# EAGLE design audino1012_ui (EAGLE 6.2)
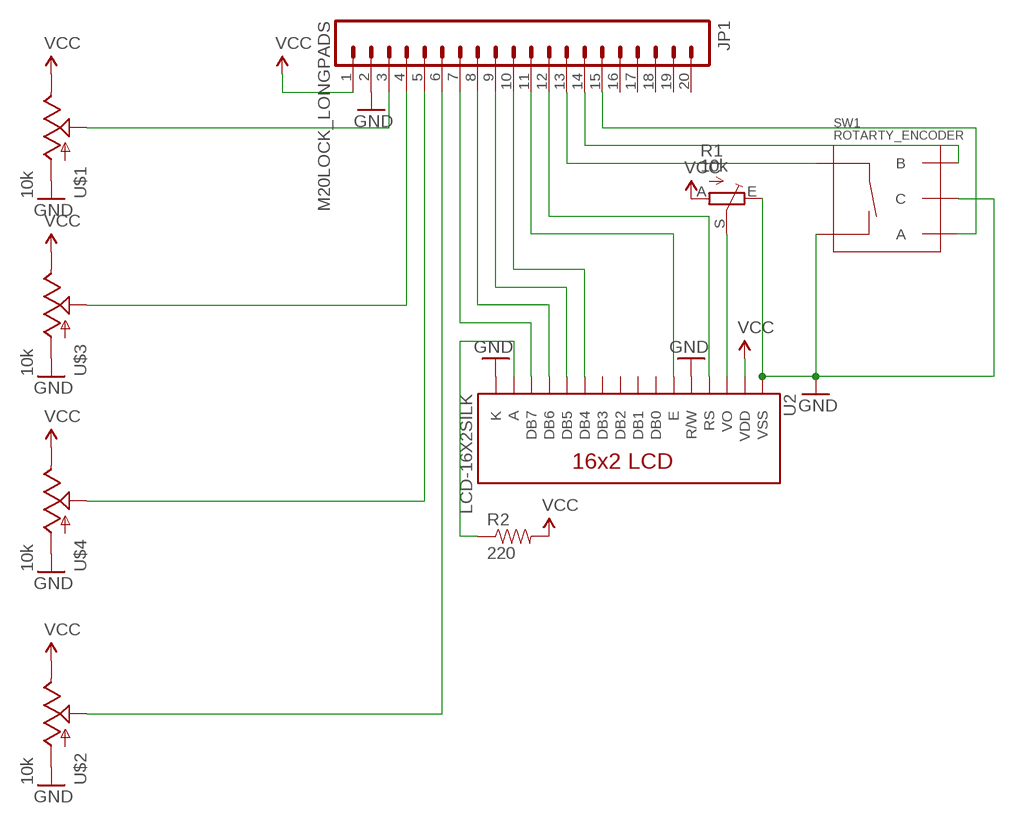
[diagram p0: schematic, sheet 1]

## Parts
JP1  M20LOCK_LONGPADS  [1X20_LOCK_LONGPADS]
R1  10k  TRIM_EU-RJ9W  [RJ9W]
R2  220  RESISTORKIT  [AXIAL-0.3-KIT]
SW1  ROTARTY_ENCODER  [ROTARY_ENC_PLAIN]
U2  LCD-16X2SILK  [LCD-16X2]
U$1  10k  POT  [ALPS_POT]
U$2  10k  POT  [ALPS_POT]
U$3  10k  POT  [ALPS_POT]
U$4  10k  POT  [ALPS_POT]

## Nets
GND: JP1.2 R1.E SW1.C SW1.SW- U2.1(VSS) U2.5(R/W) U2.16(K) U$1.P$3(A) U$2.P$3(A) U$3.P$3(A) U$4.P$3(A)
N$1: JP1.16
N$2: JP1.3 U$1.P$2(S)
N$3: JP1.4 U$3.P$2(S)
N$4: JP1.5 U$4.P$2(S)
N$5: JP1.6 U$2.P$2(S)
N$6: JP1.7 U2.14(DB7)
N$7: JP1.8 U2.13(DB6)
N$8: JP1.9 U2.12(DB5)
N$9: JP1.10 U2.11(DB4)
N$10: JP1.11 U2.6(E)
N$11: JP1.12 U2.4(RS)
N$12: R1.S U2.3(VO)
N$13: JP1.13 SW1.SW+
N$14: JP1.14 SW1.B
N$15: JP1.15 SW1.A
N$16: R2.P$1 U2.15(A)
VCC: JP1.1 R1.A R2.P$2 U2.2(VDD) U$1.P$1(E) U$2.P$1(E) U$3.P$1(E) U$4.P$1(E)
Unconnected: JP1.17 JP1.18 JP1.19 JP1.20 U2.7(DB0) U2.8(DB1) U2.9(DB2) U2.10(DB3)

## Library data of the parts
JP1 = SparkFun-Connectors:M20: 1x20 .1" header This is just like the LOCK variant in that the holes are staggared by 5 mil, but except for the last two holes. They are not altered from the "standard" footprint layout. This is used for a special purpose on the layout of our Graphic LCD Backpack. Make sure you want to use this device before selecting it for you project!
R1 = pot:TRIM_EU-: POTENTIOMETER
R2 = SparkFun-Passives:RESISTOR: Resistor Basic schematic elements and footprints for 0603, 1206, and PTH resistors.
SW1 = SparkFun-Electromechanical:ROTARTY_ENCODER: Simple no LED rotary encoder Example: COM-09117
U2 = SparkFun-Displays:LCD-16X2: Standard text-only 16x2 parallel input LCD
U$1-U$4 = SparkFun-Electromechanical:POT

## Board
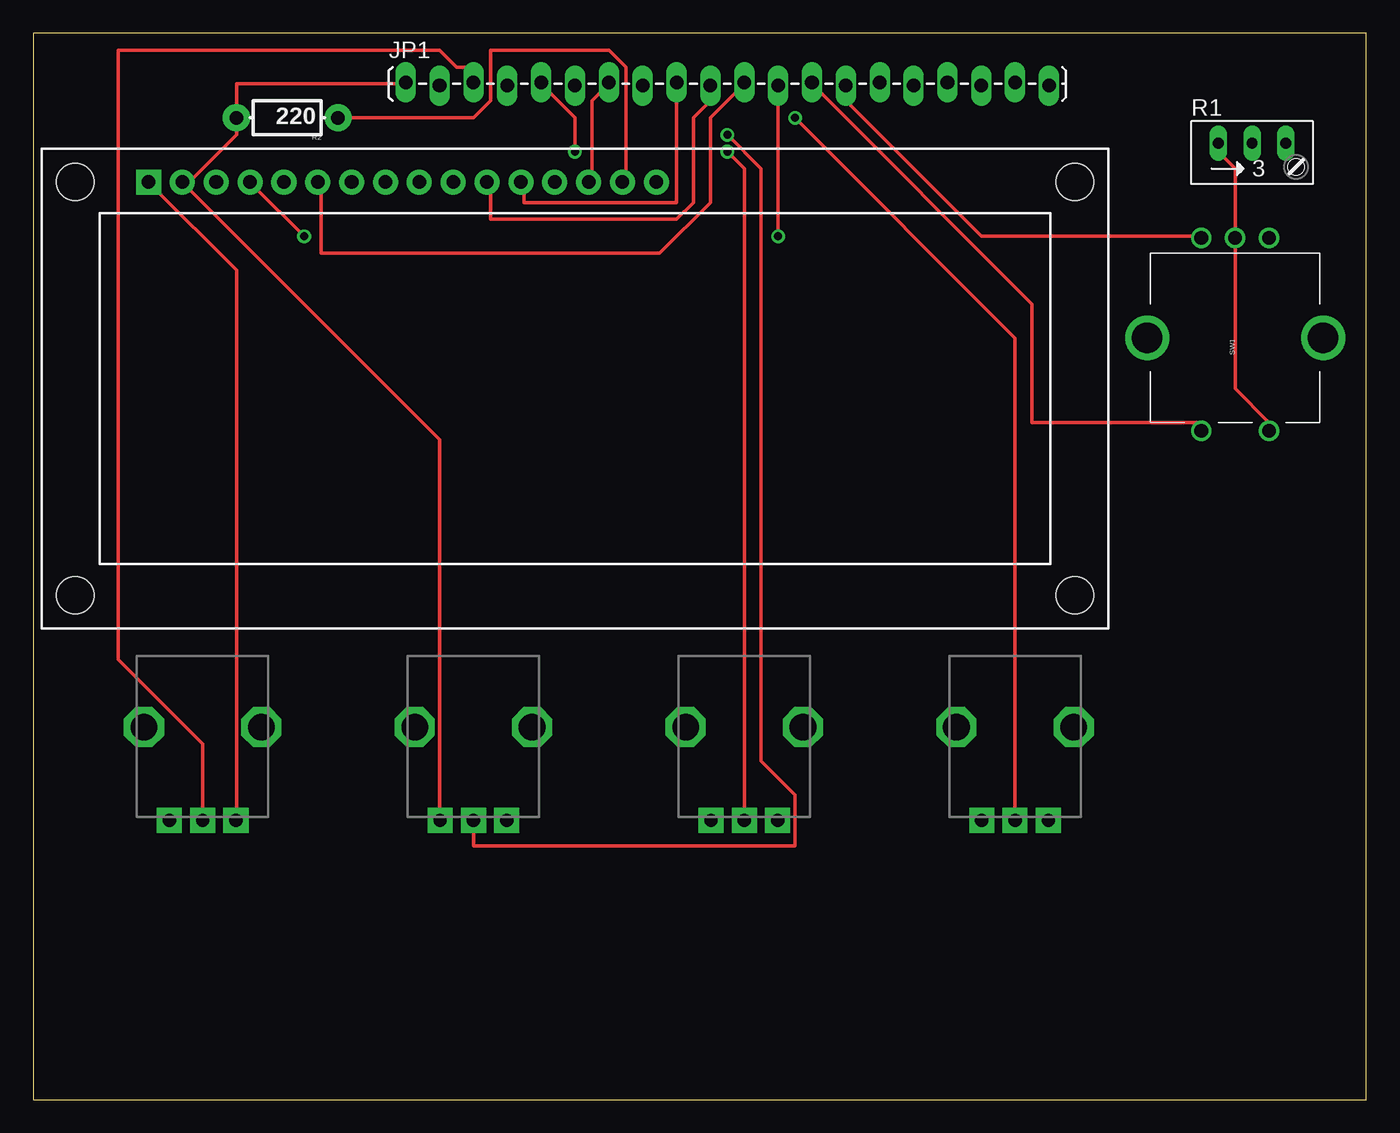
[diagram p1: board, top side]
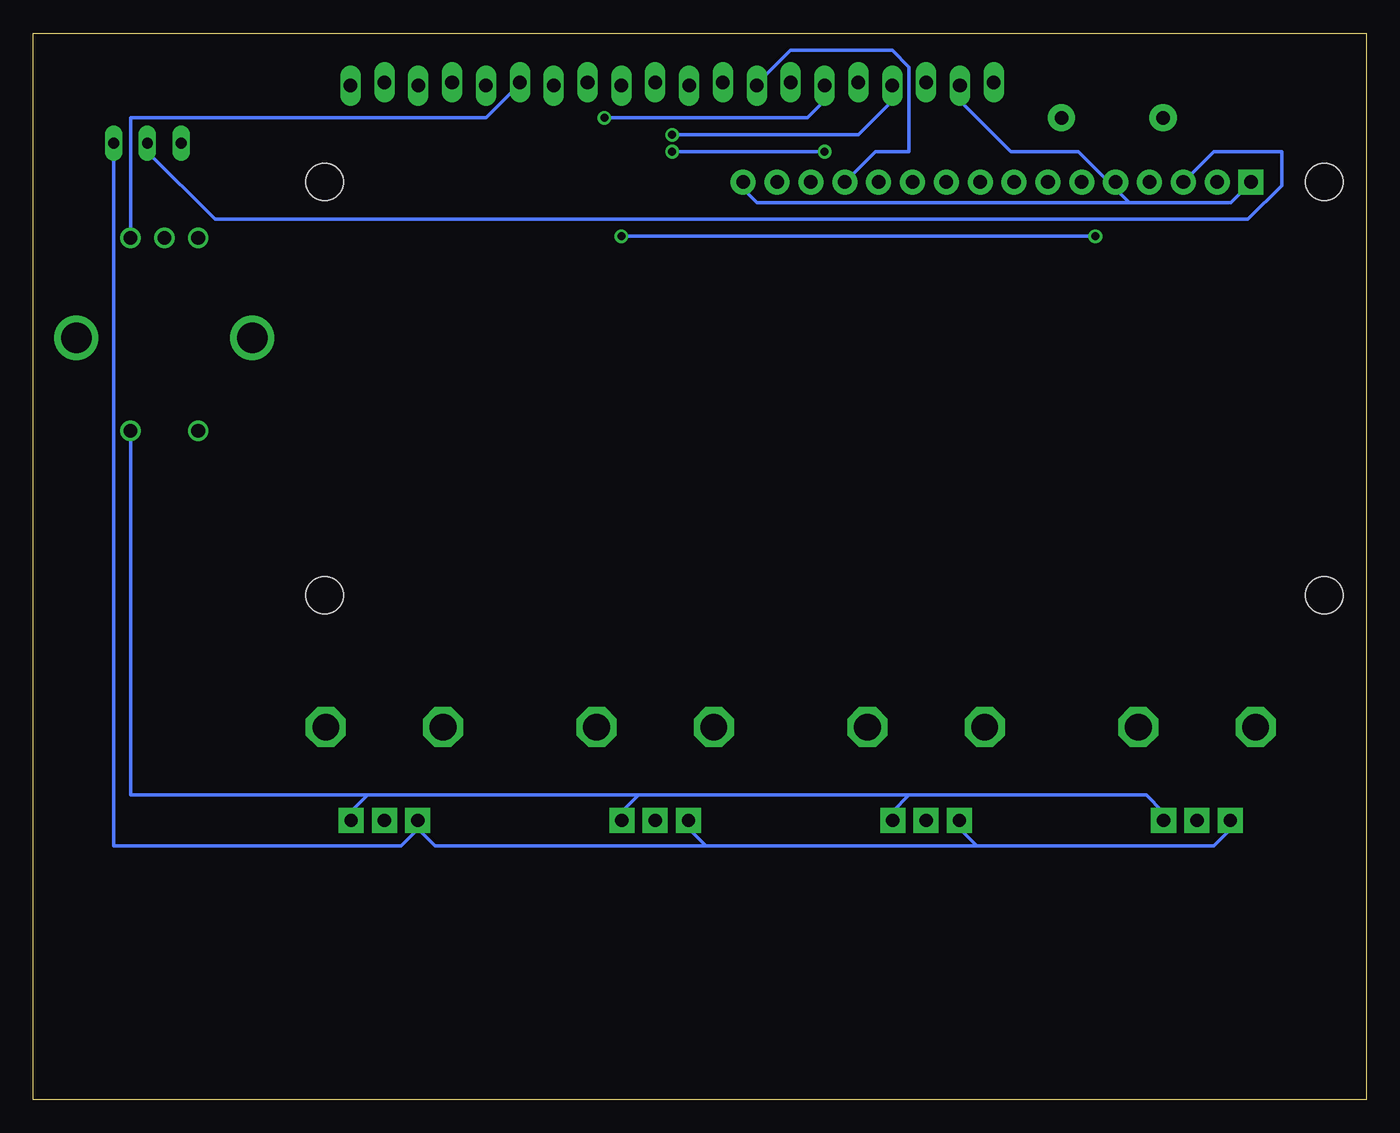
[diagram p2: board, bottom side, seen from below]

Size 100 x 80 mm. Coordinates in mm from the lower left corner, seen from the top.
Outline: 0,0 100,0 100,80 0,80 0,0
Copper layers (1*16): Top 0.035mm / dielectric 1.5mm / Bottom 0.035mm
Design rules: minimum track width 10mil, minimum drill 24mil, track to track 8mil, track to pad 8mil, pad to pad 8mil, via to via 8mil, smd to smd 8mil, copper to edge 40mil, drill to drill 8mil, minimum pad ring 10mil, minimum via ring 8mil, stop-mask expansion 4mil, vias tented up to drill 0mil, thermal gap 10mil

### Footprints (pad centres in the part's own frame; a part is rotated, then mirrored left to right if it is on the bottom)
1X20_LOCK_LONGPADS = drill 1.016 long: 1 0,0.127; 2 2.54,-0.127; 3 5.08,0.127; 4 7.62,-0.127; 5 10.16,0.127; 6 12.7,-0.127; 7 15.24,0.127; 8 17.78,-0.127; 9 20.32,0.127; 10 22.86,-0.127; 11 25.4,0.127; 12 27.94,-0.127; 13 30.48,0.127; 14 33.02,-0.127; 15 35.56,0.127; 16 38.1,-0.127; 17 40.64,0.127; 18 43.18,-0.127; 19 45.72,0.127; 20 48.26,-0.127
RJ9W = drill 0.813 long: A 2.54,0.635; E -2.54,0.635; S 0,0.635
AXIAL-0.3-KIT = drill 1.016 pad 2.032: P$1 -3.81,0; P$2 3.81,0
ROTARY_ENC_PLAIN = drill 1.016: A 7.493,-2.54; B 7.493,2.54; C 7.493,0; SW+ -6.985,2.54; SW- -6.985,-2.54 | drill 2.286: P$3 0,6.604; P$4 0,-6.604
LCD-16X2 = drill 1.016 pad 1.88 square: 1 -32,15.5 | drill 1.016 pad 1.88: 2 -29.46,15.5; 3 -26.92,15.5; 4 -24.38,15.5; 5 -21.84,15.5; 6 -19.3,15.5; 7 -16.76,15.5; 8 -14.22,15.5; 9 -11.68,15.5; 10 -9.14,15.5; 11 -6.6,15.5; 12 -4.06,15.5; 13 -1.52,15.5; 14 1.02,15.5; 15 3.56,15.5; 16 6.1,15.5 | hole 2.8: -37.5,15.5; -37.5,-15.5; 37.5,15.5; 37.5,-15.5
ALPS_POT = drill 1 pad 1.88 square: P$1 7,-2.5; P$2 7,0; P$3 7,2.5 | drill 2 octagon: P$4 0,-4.4; P$5 0,4.4

### Placement (x,y rotation side)
JP1  27.94,76.2 0 top
R1  91.44,71.12 0 top
R2  19.05,73.66 180 top
SW1  90.17,57.15 90 top
U2  40.64,53.34 0 top
U$1  12.7,27.94 270 top
U$2  73.66,27.94 270 top
U$3  33.02,27.94 270 top
U$4  53.34,27.94 270 top

### Tracks (layer width: path | path; a pad name or v marks a point on that pad's centre or on a via)
GND
  Top 0.254: R1.E 88.9,71.12 90.17,69.85 90.17,64.77 SW1.C 90.17,53.34 92.71,50.8 SW1.SW- | U2.1 8.89,68.58 15.24,62.23 15.24,21.59 U$1.P$3
  Bottom 0.254: 19.05,68.58 21.59,71.12 26.67,71.12 30.48,74.93 JP1.2 | 17.78,67.31 10.16,67.31 8.89,68.58 U2.1 | 19.05,68.58 17.78,67.31 | 19.05,68.58 U2.5 | 17.78,67.31 45.72,67.31 46.99,68.58 U2.16 | 34.29,22.86 16.51,22.86 15.24,21.59 U$1.P$3 | 34.29,22.86 35.56,21.59 U$3.P$3 | 54.61,22.86 55.88,21.59 U$4.P$3 | 34.29,22.86 54.61,22.86 | 74.93,22.86 76.2,21.59 U$2.P$3 | 54.61,22.86 74.93,22.86 | SW1.SW- 92.71,22.86 74.93,22.86
N$2
  Top 0.254: U$1.P$2 12.7,26.67 6.35,33.02 6.35,78.74 30.48,78.74 31.75,77.47 33.02,77.47 JP1.3
N$3  (via drill 0.61)
  Top 0.254: v52.07,72.39 54.61,69.85 54.61,25.4 57.15,22.86 57.15,19.05 33.02,19.05 U$3.P$2
  Bottom 0.254: v52.07,72.39 38.1,72.39 35.56,74.93 JP1.4
N$4  (via drill 0.61)
  Top 0.254: v40.64,71.12 40.64,73.66 38.1,76.2 JP1.5 | v52.07,71.12 53.34,69.85 U$4.P$2
  Bottom 0.254: v52.07,71.12 v40.64,71.12
N$5  (via drill 0.61)
  Top 0.254: v57.15,73.66 73.66,57.15 U$2.P$2
  Bottom 0.254: v57.15,73.66 41.91,73.66 40.64,74.93 JP1.6
N$6
  Top 0.254: JP1.7 43.18,76.2 41.91,74.93 41.91,68.58 U2.14
N$7
  Bottom 0.254: JP1.8 45.72,76.2 43.18,78.74 35.56,78.74 34.29,77.47 34.29,71.12 36.83,71.12 39.37,68.58 U2.13
N$8
  Top 0.254: JP1.9 48.26,67.31 36.83,67.31 36.83,68.58 U2.12
N$9
  Top 0.254: JP1.10 50.8,74.93 49.53,73.66 49.53,67.31 48.26,66.04 34.29,66.04 34.29,68.58 U2.11
N$10
  Top 0.254: JP1.11 53.34,76.2 50.8,73.66 50.8,67.31 46.99,63.5 21.59,63.5 21.59,68.58 U2.6
N$11  (via drill 0.61)
  Top 0.254: v55.88,64.77 JP1.12 | v20.32,64.77 16.51,68.58 U2.4
  Bottom 0.254: v20.32,64.77 v55.88,64.77
N$12
  Bottom 0.254: R1.S 91.44,71.12 86.36,66.04 8.89,66.04 6.35,68.58 6.35,71.12 11.43,71.12 13.97,68.58 U2.3
N$13
  Top 0.254: SW1.SW+ 87.63,50.8 74.93,50.8 74.93,59.69 58.42,76.2 JP1.13
N$14
  Top 0.254: JP1.14 60.96,74.93 71.12,64.77 87.63,64.77 SW1.B
N$15
  Bottom 0.254: SW1.A 92.71,73.66 66.04,73.66 63.5,76.2 JP1.15
N$16
  Top 0.254: R2.P$1 33.02,73.66 34.29,74.93 34.29,78.74 43.18,78.74 44.45,77.47 44.45,68.58 U2.15
VCC
  Top 0.254: JP1.1 27.94,76.2 15.24,76.2 R2.P$2 15.24,72.39 11.43,68.58 | 11.43,68.58 30.48,49.53 30.48,21.59 U$3.P$1 | 11.43,68.58 U2.2
  Bottom 0.254: R1.A 93.98,19.05 72.39,19.05 71.12,20.32 | 29.21,19.05 11.43,19.05 10.16,20.32 U$1.P$1 | 29.21,19.05 30.48,20.32 U$3.P$1 | 49.53,19.05 50.8,20.32 U$4.P$1 | 29.21,19.05 49.53,19.05 | 71.12,20.32 69.85,19.05 49.53,19.05 | 71.12,20.32 U$2.P$1